# Altium schematic sheet Power Supply.SchDoc
size A4; SheetNumber: 3; SheetTotal: 11
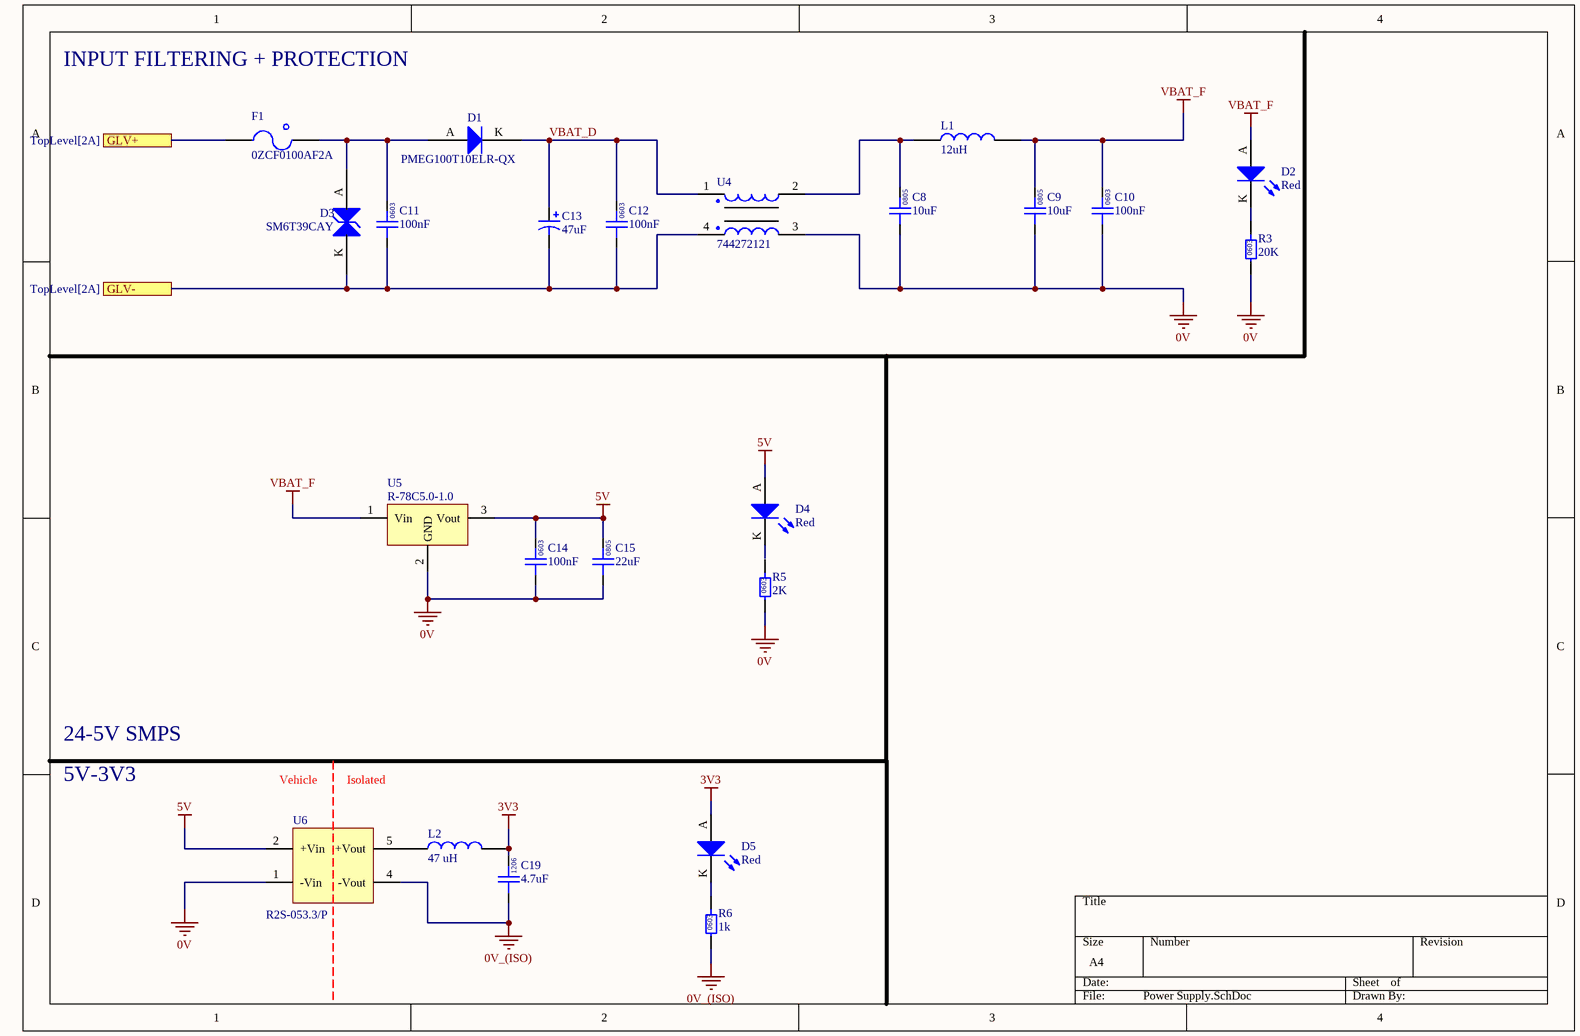
[diagram p0: Power Supply.SchDoc]

## Parts
C8  10uF  [0805]
C9  10uF  [0805]
C10  100nF  [0603]
C11  100nF  [0603]
C12  100nF  [0603]
C13  47uF  [CHEMI-CON ELCO]
C14  100nF  [0603]
C15  22uF  [0805]
C19  4.7uF  [1206 CAP]
D1  PMEG100T10ELR-QX  [SODFL350X110-2N]
D2  Red  [0805 LED]
D3  SM6T39CAY  [SM6T39CAY-Footprint-1]
D4  Red  [0805 LED]
D5  Red  [0805 LED]
F1  0ZCF0100AF2A  [2920]
L1  12uH  [1812]
L2  47 uH  [82473C]
R3  20K  [0603]
R5  2K  [0603]
R6  1k  [0603]
U4  744272121  [Wurth 4-PC Pad]
U5  R-78C5.0-1.0  [RECOM 3-SIP]
U6  R2S-053.3/P  [RECOM 8-SMD (5 Pin)]

## Ports
GLV+ (see TopLevel[2A]), GLV- (see TopLevel[2A])

## Nets
0V: C8.1 C9.1 C10.1 C14.1 C15.1 R3.1 R5.1 U4.3 U5.2(GND) U6.1(-Vin)
0V_(ISO): C19.1 R6.1 U6.4(-Vout)
3V3: C19.2 D5.A L2.1
5V: C14.2 C15.2 D4.A U5.3(Vout) U6.2(+Vin)
VBAT_F: C9.2 C10.2 D2.A L1.1 U5.1(Vin)
GLV+: F1.1 ; port GLV+
GLV-: C11.1 C12.1 C13.1 D3.K U4.4 ; port GLV-
VBAT_D: C12.2 C13.2 D1.K U4.1
NetC8_2: C8.2 L1.2 U4.2
NetC11_2: C11.2 D1.A D3.A F1.2
NetD2_K: D2.K R3.2
NetD5_K: D5.K R6.2
NetL2_2: L2.2 U6.5(+Vout)

Not connected (* = marked no-connect by the designer): D4 K; R5 2

## Notes on the sheet
- INPUT FILTERING + PROTECTION
- 24-5V SMPS
- 5V-3V3
- Vehicle
- Isolated
- (in symbol GCM188L81H104KA57D) 0603
- (in symbol GRM21BR6YA106KE43L) 0805
- (in symbol GRM21BR61A226ME51L) 0805
- (in symbol GRM31CR71H475KA12K) 1206
- (in symbol RC0603FR-071KL) 0603
- (in symbol RC0603FR-072KL) 0603
- (in symbol RC0603FR-0720KL) 0603

## Library data of the parts
C8 C9 = GRM21BR6YA106KE43L: Manufacturer: muRata; Rated Voltage: 50V; Tolerance: 10%; Material: MLCC; Temperature Rating: X5R; Part Number: GRM21BR6YA106KE43L; Value: 10uF; Digikey Part Number: 490-10514-6-ND
C10-C12 C14 = GCM188L81H104KA57D: Manufacturer: muRata; Rated Voltage: 50V; Tolerance: ±10%; Material: MLCC; Temperature Rating: X8L; Part Number: GCM188L81H104KA57D; Value: 100nF; Digikey Part Number: 490-6049-1-ND
C13 = HHXA350ARA470MF61G: Part Number: HHXA350ARA470MF61G
C15 = GRM21BR61A226ME51L: Manufacturer: muRata; Rated Voltage: 10V; Tolerance: 20%; Material: MLCC; Temperature Rating: X5R; Part Number: GRM21BR61A226ME51L; Value: 22uF; Digikey Part Number: 490-10511-1-ND
C19 = GRM31CR71H475KA12K: Manufacturer: Murata Electronics; Rated Voltage: 50V; Tolerance: ±10%; Material: MLCC; Temperature Rating: X7R; Part Number: GRM31CR71H475KA12K; Value: 4.7uF; Digikey Part Number: 490-GRM31CR71H475KA12KTR-ND
D1 = CMP-004-00005-4: Diode 100 V 1A Surface Mount SOD-123W
D2 D4 D5 = SML-210LTT86: Red LED Indication - Discrete 1.75V 0805 (2012 Metric); Manufacturer: ROHM Semiconductor; Part Number: SML-210LTT86; Colour: Red; Digikey Part Number: 511-1286-1-ND
D3 = CMP-004-00003-4: TVS Diode Single Bi-Dir 33.3V 600W Automotive 2-Pin SMB T/R / TVS DIODE 33.3VWM 69.7VC SMB; Peak Pulse Current: 57A; Polarity: Bidirectional; Min Breakdown Voltage: 37.1V; Test Current: 1mA; Number of Elements: 1; Operating Supply Voltage: 30V; Diode Type: ZENER; Clamping Voltage: 53.9V; Leakage Current: 200nA; Power Line Protection: No; Max Surge Current: 11.1A; Max Breakdown Voltage: 41V; Breakdown Voltage: 39V; Max Power Dissipation: 600W; Radiation Hardening: No; Resistor Type: Zener; Termination: SMD/SMT; REACH SVHC: No SVHC; Reverse Breakdown Voltage: 37.1V; Max Operating Temperature: 150°C; Min Operating Temperature: -55°C; Element Configuration: Single; Length: 4.6mm; Case/Package: DO-214AA; Reverse Standoff Voltage: 33.3V; Number of Bidirectional Channels: 1; Number of Pins: 2; Direction: Bidirectional; Mount: Surface Mount; Package Quantity: 1; Width: 3.95mm; RoHS Compliant: Yes; Number of Channels: 1; Packaging: Tape and Reel; Max Reverse Leakage Current: 200nA; Peak Pulse Power: 600W; Height: 2.45mm; Series: Automotive, AEC-Q101, SM6TY, TRANSIL™
F1 = 0ZCF0100AF2A: PTC RESET FUSE 60V 1A 292; Manufacturer: Littelfuse Inc.; Part Number: 0ZCF0100AF2A; Digikey Part Number: 507-2070-1-ND; Digikey Link: https://www.digikey.com/product-detail/en/bel-fuse-inc/0ZCF0100AF2A/507-2070-1-ND/6210547
L1 = RLS-126: Manufacturer: Recom; Tolerance: 0.2; Impedance: 230mOhm; Rated Current: 0.8 A; Material: Wirewound; Part Number: RLS-126; Value: 12uH; Digikey Part Number: 945-3429-ND
L2 = 82473C: Manufacturer: Murata Power Solutions Inc.; Tolerance: 0.1; Impedance: 1.69 Ohms; Rated Current: 250mA; Material: Wirewound; Part Number: 82473C; Value: 47 uH; Digikey Part Number: 811-2477-2-ND
R3 = RC0603FR-0720KL: Manufacturer: YAGEO; Tolerance: 0.01; Rated Power: 0.1W; Part Number: RC0603FR-0720KL; Value: 20K; Digikey Part Number: 311-20.0KHRCT-ND; Material: FR-07
R5 = RC0603FR-072KL: Manufacturer: YAGEO; Tolerance: 0.01; Rated Power: 0.1W; Part Number: RC0603FR-072KL; Value: 2K; Digikey Part Number: 311-2.00KHRCT-ND; Material: FR-07
R6 = RC0603FR-071KL: Manufacturer: YAGEO; Tolerance: 0.01; Rated Power: 0.1W; Part Number: RC0603FR-071KL; Value: 1k; Digikey Part Number: 311-1.00KHRCT-ND; Material: FR-07
U4 = 744272121: Manufacturer: Wurth Electronics Inc; Value: 120uH @ 100kHz; Impedance: 460 Ohms @ 30MHz; Rated Current: 2.5 A; Part Number: 744272121; Material: Wirewound; Digikey Part Number: 732-1489-1-ND
U5 = R-78C5.0-1.0: CONV DC/DC 1A 5V OUT SIP VERT; Manufacturer: Recom; Input Voltage: 8 to 42 V; Output Current: 1.0 A; Part Number: R-78C5.0-1.0; Output Voltage: 5V; Digikey Part Number: 945-1395-5-ND
U6 = R2S-053.3/P: Isolated Module DC DC Converter 1 Output 3.3V 606mA 4.5V - 5.5V Input; Manufacturer: Recom; Part Number: R2S-053.3/P; Input Voltage: 4.5V-5.5V; Output Voltage: 3.3V; Output Current: 606mA; Digikey Part Number: 945-2677-5-ND